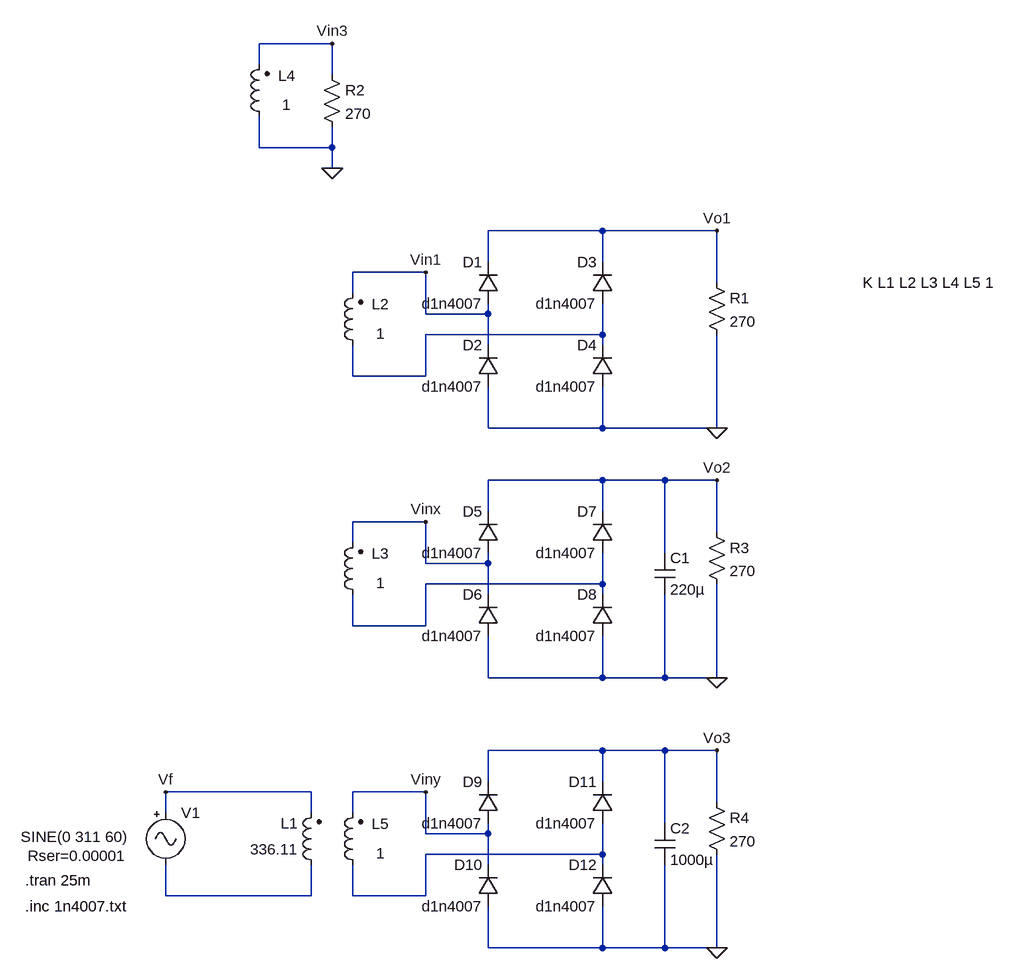
[diagram p0: schematic ponte retific.asc]
ponte retific.asc, the LTspice schematic file:
Version 4
SHEET 1 880 1076
WIRE -304 -336 -416 -336
WIRE -416 -304 -416 -336
WIRE -304 -288 -304 -336
WIRE -416 -176 -416 -224
WIRE -304 -176 -304 -208
WIRE -304 -176 -416 -176
WIRE -304 -144 -304 -176
WIRE 112 -48 -64 -48
WIRE 288 -48 112 -48
WIRE -64 0 -64 -48
WIRE 112 0 112 -48
WIRE -160 16 -272 16
WIRE 288 32 288 -48
WIRE -272 48 -272 16
WIRE -160 80 -160 16
WIRE -64 80 -64 64
WIRE -64 80 -160 80
WIRE 112 112 112 64
WIRE 112 112 -160 112
WIRE -64 128 -64 80
WIRE 112 128 112 112
WIRE -272 176 -272 128
WIRE -160 176 -160 112
WIRE -160 176 -272 176
WIRE -64 256 -64 192
WIRE 112 256 112 192
WIRE 112 256 -64 256
WIRE 288 256 288 112
WIRE 288 256 112 256
WIRE 112 336 -64 336
WIRE 208 336 112 336
WIRE 288 336 208 336
WIRE -64 384 -64 336
WIRE 112 384 112 336
WIRE -160 400 -272 400
WIRE 288 416 288 336
WIRE -272 432 -272 400
WIRE 208 448 208 336
WIRE -160 464 -160 400
WIRE -64 464 -64 448
WIRE -64 464 -160 464
WIRE 112 496 112 448
WIRE 112 496 -160 496
WIRE -64 512 -64 464
WIRE 112 512 112 496
WIRE -272 560 -272 512
WIRE -160 560 -160 496
WIRE -160 560 -272 560
WIRE -64 640 -64 576
WIRE 112 640 112 576
WIRE 112 640 -64 640
WIRE 208 640 208 512
WIRE 208 640 112 640
WIRE 288 640 288 496
WIRE 288 640 208 640
WIRE 112 752 -64 752
WIRE 208 752 112 752
WIRE 288 752 208 752
WIRE -64 800 -64 752
WIRE 112 800 112 752
WIRE -336 816 -560 816
WIRE -160 816 -272 816
WIRE 288 832 288 752
WIRE -560 848 -560 816
WIRE -336 848 -336 816
WIRE -272 848 -272 816
WIRE 208 864 208 752
WIRE -160 880 -160 816
WIRE -64 880 -64 864
WIRE -64 880 -160 880
WIRE 112 912 112 864
WIRE 112 912 -160 912
WIRE -64 928 -64 880
WIRE 112 928 112 912
WIRE -560 976 -560 928
WIRE -336 976 -336 928
WIRE -336 976 -560 976
WIRE -272 976 -272 928
WIRE -160 976 -160 912
WIRE -160 976 -272 976
WIRE -64 1056 -64 992
WIRE 112 1056 112 992
WIRE 112 1056 -64 1056
WIRE 208 1056 208 928
WIRE 208 1056 112 1056
WIRE 288 1056 288 912
WIRE 288 1056 208 1056
FLAG -560 816 Vf
FLAG 288 -48 Vo1
FLAG -160 16 Vin1
FLAG 288 256 0
FLAG -304 -336 Vin3
FLAG -304 -144 0
FLAG 288 336 Vo2
FLAG -160 400 Vinx
FLAG 288 640 0
FLAG 288 752 Vo3
FLAG -160 816 Viny
FLAG 288 1056 0
SYMBOL Misc\\signal -560 832 R0
WINDOW 123 0 0 Left 0
WINDOW 39 -212 82 Left 2
WINDOW 3 -223 53 Left 2
SYMATTR SpiceLine Rser=0.00001
SYMATTR Value SINE(0 311 60)
SYMATTR InstName V1
SYMBOL diode -48 64 R180
WINDOW 0 24 64 Left 2
WINDOW 3 24 0 Left 2
SYMATTR InstName D1
SYMATTR Value d1n4007
SYMBOL res 272 16 R0
SYMATTR InstName R1
SYMATTR Value 270
SYMBOL ind2 -320 944 R180
WINDOW 0 36 80 Left 2
WINDOW 3 36 40 Left 2
SYMATTR InstName L1
SYMATTR Value 336.11
SYMATTR Type ind
SYMBOL ind2 -256 144 R180
WINDOW 0 -40 79 Left 2
WINDOW 3 -33 34 Left 2
SYMATTR InstName L2
SYMATTR Value 1
SYMATTR Type ind
SYMBOL diode -48 192 R180
WINDOW 0 24 64 Left 2
WINDOW 3 24 0 Left 2
SYMATTR InstName D2
SYMATTR Value d1n4007
SYMBOL diode 128 64 R180
WINDOW 0 24 64 Left 2
WINDOW 3 24 0 Left 2
SYMATTR InstName D3
SYMATTR Value d1n4007
SYMBOL diode 128 192 R180
WINDOW 0 24 64 Left 2
WINDOW 3 24 0 Left 2
SYMATTR InstName D4
SYMATTR Value d1n4007
SYMBOL ind2 -400 -208 R180
WINDOW 0 -40 79 Left 2
WINDOW 3 -33 34 Left 2
SYMATTR InstName L4
SYMATTR Value 1
SYMATTR Type ind
SYMBOL res -320 -304 R0
SYMATTR InstName R2
SYMATTR Value 270
SYMBOL diode -48 448 R180
WINDOW 0 24 64 Left 2
WINDOW 3 24 0 Left 2
SYMATTR InstName D5
SYMATTR Value d1n4007
SYMBOL res 272 400 R0
SYMATTR InstName R3
SYMATTR Value 270
SYMBOL ind2 -256 528 R180
WINDOW 0 -40 79 Left 2
WINDOW 3 -33 34 Left 2
SYMATTR InstName L3
SYMATTR Value 1
SYMATTR Type ind
SYMBOL diode -48 576 R180
WINDOW 0 24 64 Left 2
WINDOW 3 24 0 Left 2
SYMATTR InstName D6
SYMATTR Value d1n4007
SYMBOL diode 128 448 R180
WINDOW 0 24 64 Left 2
WINDOW 3 24 0 Left 2
SYMATTR InstName D7
SYMATTR Value d1n4007
SYMBOL diode 128 576 R180
WINDOW 0 24 64 Left 2
WINDOW 3 24 0 Left 2
SYMATTR InstName D8
SYMATTR Value d1n4007
SYMBOL cap 192 448 R0
SYMATTR InstName C1
SYMATTR Value 220µ
SYMBOL diode -48 864 R180
WINDOW 0 24 64 Left 2
WINDOW 3 24 0 Left 2
SYMATTR InstName D9
SYMATTR Value d1n4007
SYMBOL res 272 816 R0
SYMATTR InstName R4
SYMATTR Value 270
SYMBOL ind2 -256 944 R180
WINDOW 0 -40 79 Left 2
WINDOW 3 -33 34 Left 2
SYMATTR InstName L5
SYMATTR Value 1
SYMATTR Type ind
SYMBOL diode -48 992 R180
WINDOW 0 24 64 Left 2
WINDOW 3 24 0 Left 2
SYMATTR InstName D10
SYMATTR Value d1n4007
SYMBOL diode 128 864 R180
WINDOW 0 24 64 Left 2
WINDOW 3 24 0 Left 2
SYMATTR InstName D11
SYMATTR Value d1n4007
SYMBOL diode 128 992 R180
WINDOW 0 24 64 Left 2
WINDOW 3 24 0 Left 2
SYMATTR InstName D12
SYMATTR Value d1n4007
SYMBOL cap 192 864 R0
SYMATTR InstName C2
SYMATTR Value 1000µ
TEXT -776 952 Left 2 !.tran 25m
TEXT 512 32 Left 2 !K L1 L2 L3 L4 L5 1
TEXT -776 992 Left 2 !.inc 1n4007.txt

The netlist it stands for:
* ponte retific.asc
V1 Vf N004 SINE(0 311 60) Rser=0.00001
D1 Vin1 Vo1 d1n4007
R1 Vo1 0 270
L1 N004 Vf 336.11
L2 N001 Vin1 1
D2 0 Vin1 d1n4007
D3 N001 Vo1 d1n4007
D4 0 N001 d1n4007
L4 0 Vin3 1
R2 Vin3 0 270
D5 Vinx Vo2 d1n4007
R3 Vo2 0 270
L3 N002 Vinx 1
D6 0 Vinx d1n4007
D7 N002 Vo2 d1n4007
D8 0 N002 d1n4007
C1 Vo2 0 220µ
D9 Viny Vo3 d1n4007
R4 Vo3 0 270
L5 N003 Viny 1
D10 0 Viny d1n4007
D11 N003 Vo3 d1n4007
D12 0 N003 d1n4007
C2 Vo3 0 1000µ
.model D D
.lib standard.dio
.tran 25m
K L1 L2 L3 L4 L5 1
.inc 1n4007.txt
.backanno
.end